# EAGLE design A4a STM32 (EAGLE 9.6.2)
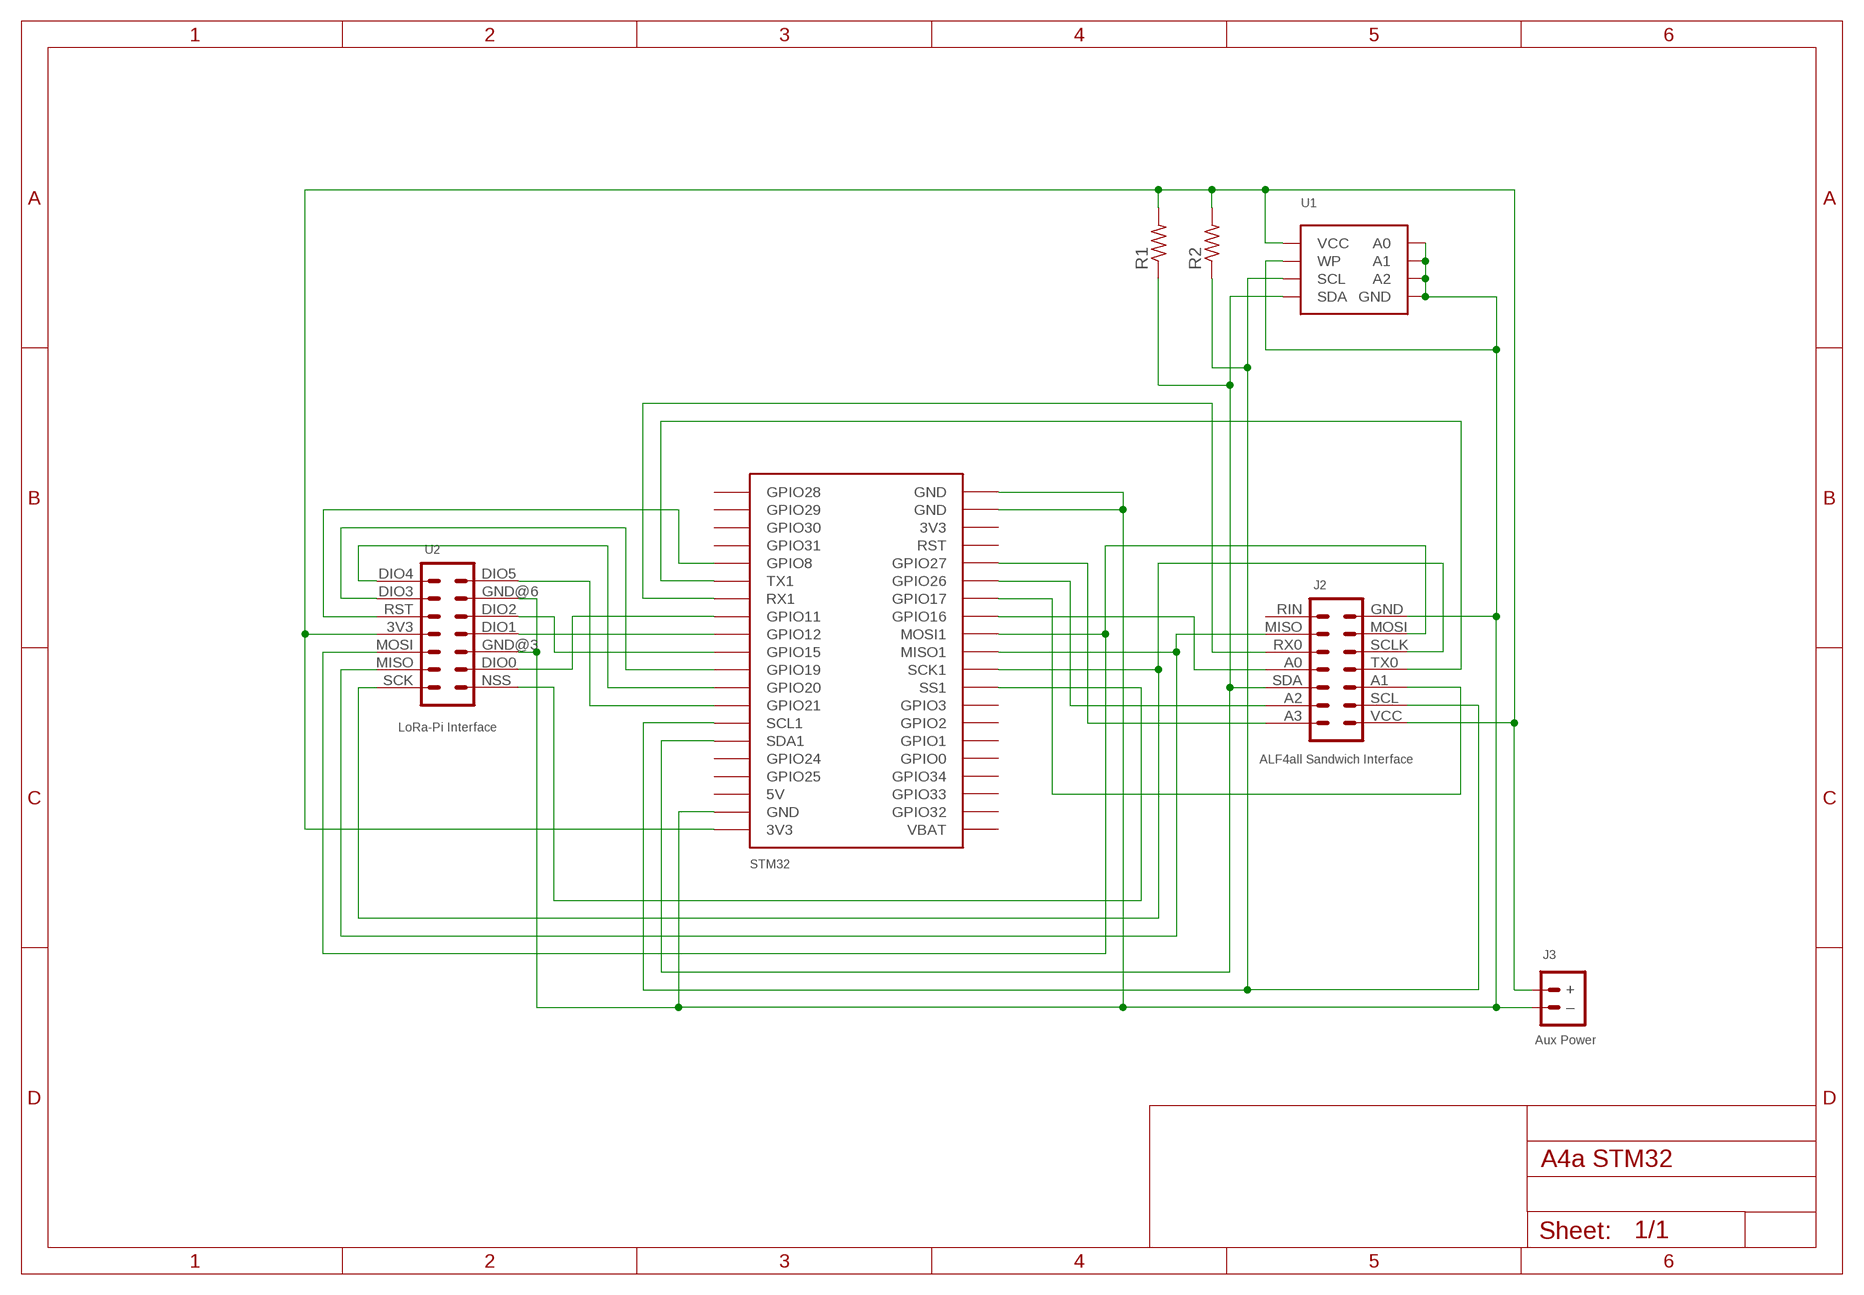
[diagram p0: schematic, sheet 1]

## Parts
J1  STM32  [STM32]
J2  ALF4all Sandwich Interface  HEADER-3X5-ALF4ALL-STM32-INTERCONNECT  [CONN_3X5-ALF4ALL-STM32-INTERCONNECT]
J3  Aux Power  JST-PH2.0-2-MALE-HORIZONTALJST-PTH-2  [JST-PH2.0-2-HORIZONTAL]
R1  RESISTORR0805  [R0805]
R2  RESISTORR0805  [R0805]
U1  AT24CXX-EEPROM-VIA-4  [SOP-8-WITH-VIA-4]
U2  LoRa-Pi Interface  RFM95W-PI-HEADER  [RFM95W-PI]

## Nets
GND: J1.GND@19(GND) J1.GND@20(GND) J1.GND@39(GND) J2.GND J3.-(–) U1.P$1(A0) U1.P$2(A1) U1.P$3(A2) U1.P$4(GND) U1.P$4@VIA(GND) U1.P$7(WP) U2.GND@3 U2.GND@6
N$1: J1.GPIO10(RX1) J2.RX0
N$2: J1.GPIO26 J2.A2
N$3: J1.GPIO22(SCL1) J2.SCL R2.1 U1.P$6(SCL)
N$4: J1.GPIO23(SDA1) J2.SDA R1.1 U1.P$5(SDA)
N$5: J1.GPIO16 J2.A0
N$6: J1.GPIO9(TX1) J2.TX0
N$7: J1.GPIO7(MOSI1) J2.MOSI U2.MOSI
N$8: J1.GPIO6(MISO1) J2.MISO U2.MISO
N$9: J1.GPIO27 J2.A3
N$11: J1.GPIO5(SCK1) J2.SCLK U2.SCK
N$12: J1.GPIO4(SS1) U2.NSS
N$13: J1.GPIO11 U2.DIO0
N$14: J1.GPIO12 U2.DIO1
N$15: J1.GPIO15 U2.DIO2
N$16: J1.GPIO19 U2.DIO3
N$17: J1.GPIO20 U2.DIO4
N$18: J1.GPIO21 U2.DIO5
N$19: J1.GPIO8 U2.RST
N$21: J1.GPIO17 J2.A1
VCC: J1.3V3@40(3V3) J2.VCC J3.+ R1.2 R2.2 U1.P$8(VCC) U2.3V3
Unconnected: J1.3V3@18(3V3) J1.5V@38(5V) J1.GPIO0 J1.GPIO1 J1.GPIO2 J1.GPIO3 J1.GPIO24 J1.GPIO25 J1.GPIO28 J1.GPIO29 J1.GPIO30 J1.GPIO31 J1.GPIO32 J1.GPIO33 J1.GPIO34 J1.RST J1.VBAT J2.RIN

## Library data of the parts
J1 = digitalconcepts:STM32: STM32 Development Board
J2 = digitalconcepts:HEADER-3X5-ALF4ALL-STM32-INTERCONNECT: ALF4all 'Sandwich' STM32 Interconnect 3x5 Pin Header Header soldered to top side of PCB
J3 = digitalconcepts:JST-PH2.0-2-MALE-HORIZONTAL: Multi connection point. Often used as Generic Header-pin footprint for 0.1 inch spaced/style header connections On any of the 0.1 inch spaced packages, you can populate with these: Break Away Headers - Straight <https://www.sparkfun.com/products/116> (PRT-00116) Break Away Male Headers - Right Angle <https://www.sparkfun.com/products/553> (PRT-00553) Female Headers <https://www.sparkfun.com/products/115> (PRT-00115) Break Away Headers - Machine Pin <https://www.sparkfun.com/products/117> (PRT-00117) Break Away Female Headers - Swiss Machine Pin <https://www.sparkfun.com/products/743> (PRT-00743) For SCREWTERMINALS and SPRING TERMINALS visit here: Screw Terimnals on SparkFun.com <https://www.sparkfun.com/search/results?term=Screw+Terminals> (5mm/3.5mm/2.54mm spacing) This device is also useful as a general connection point to wire up your design to another part of your project. Our various solder wires solder well into these plated through hole pads. Hook-Up Wire - Assortment (Stranded, 22 AWG) <https://www.sparkfun.com/products/11375> (PRT-11375) Hook-Up Wire - Assortment (Solid Core, 22 AWG) <https://www.sparkfun.com/products/11367> (PRT-11367) View the entire wire category on our website here <https://www.sparkfun.com/categories/141> Special notes: Molex polarized connector foot print use with: PRT-08233 with associated crimp pins and housings. 2.54_SCREWTERM for use with PRT-10571. 3.5mm Screw Terminal footprints for PRT-08084 5mm Screw Terminal footprints for use with PRT-08432; PROD_ID: CONN-09863; SKU: PRT-09914
R1 R2 = digitalconcepts:RESISTOR: Resistor; SPICEPREFIX: R
U1 = digitalconcepts:AT24CXX-EEPROM-VIA-4: AT24Cxx EEPROM SOP-8
U2 = digitalconcepts:RFM95W-PI-HEADER: RFM95W LoRa Wireless Transceiver Raspberry Pi Daughter Board

## Board
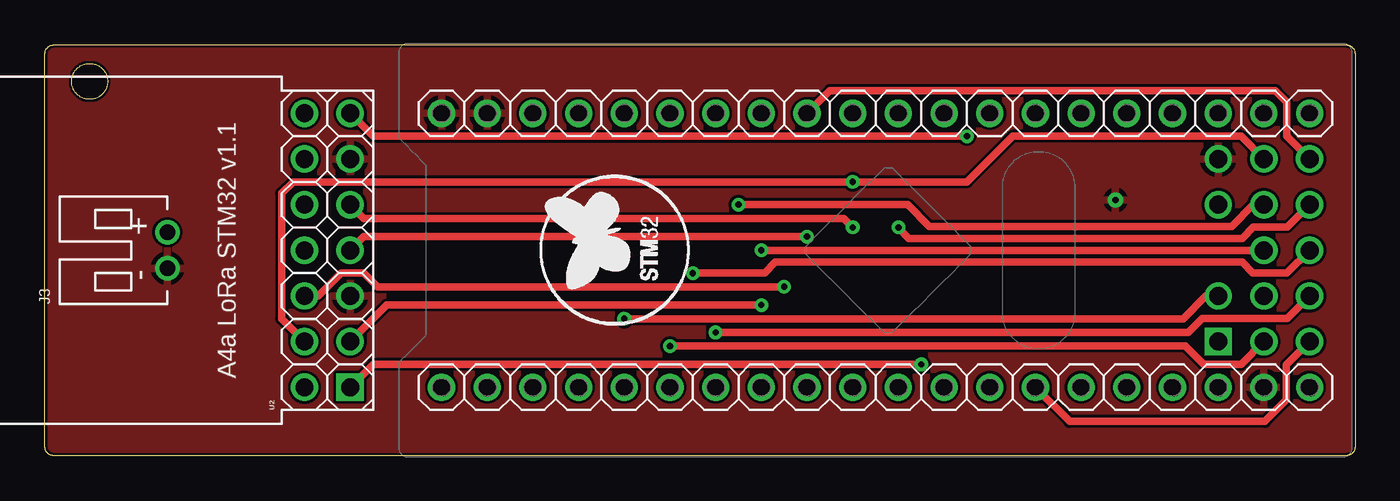
[diagram p1: board, top side]
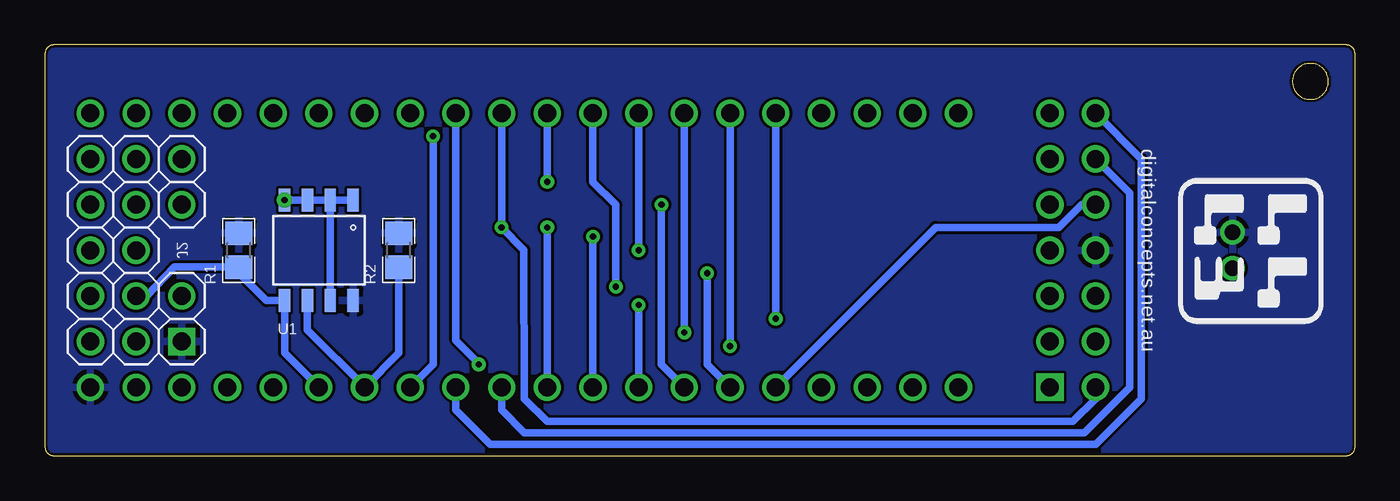
[diagram p2: board, bottom side, seen from below]

Size 72.84 x 22.86 mm. Coordinates in mm from the lower left corner, seen from the top.
Outline: 72.38,22.86 72.41,22.85 72.44,22.85 72.48,22.84 72.51,22.83 72.54,22.82 72.57,22.81 72.59,22.79 72.62,22.77 72.65,22.75 72.67,22.73 72.69,22.71 72.71,22.69 72.74,22.66 72.75,22.64 72.77,22.61 72.79,22.58 72.8,22.55 72.81,22.52 72.82,22.49 72.83,22.46 72.83,22.43 72.84,22.39 72.84,0.47 72.83,0.43 72.83,0.4 72.82,0.37 72.81,0.34 72.8,0.31 72.79,0.28 72.77,0.25 72.75,0.22 72.74,0.19 72.71,0.17 72.69,0.15 72.67,0.12 72.65,0.1 72.62,0.09 72.59,0.07 72.57,0.05 72.54,0.04 72.51,0.03 72.48,0.02 72.44,0.01 72.41,0 72.38,0 0.46,0 0.43,0 0.39,0.01 0.36,0.02 0.33,0.03 0.3,0.04 0.27,0.05 0.24,0.07 0.22,0.09 0.19,0.1 0.17,0.12 0.14,0.15 0.12,0.17 0.1,0.19 0.08,0.22 0.07,0.25 0.05,0.28 0.03,0.34 0.02,0.37 0.01,0.4 0,0.43 0,0.47 0,22.39 0,22.43 0.01,22.46 0.02,22.49 0.03,22.52 0.05,22.58 0.07,22.61 0.08,22.64 0.1,22.66 0.12,22.69 0.14,22.71 0.17,22.73 0.19,22.75 0.22,22.77 0.24,22.79 0.27,22.81 0.3,22.82 0.33,22.83 0.36,22.84 0.39,22.85 0.43,22.85 0.46,22.86 72.38,22.86
Outline: 2.55,21.83 2.62,21.82 2.68,21.81 2.75,21.79 2.81,21.77 2.87,21.75 2.93,21.72 2.99,21.69 3.04,21.66 3.09,21.62 3.14,21.58 3.19,21.53 3.23,21.49 3.27,21.44 3.31,21.39 3.35,21.33 3.38,21.28 3.4,21.22 3.43,21.16 3.45,21.09 3.46,21.03 3.47,20.96 3.48,20.9 3.48,20.76 3.47,20.69 3.46,20.63 3.45,20.56 3.43,20.5 3.4,20.44 3.38,20.38 3.35,20.32 3.31,20.27 3.27,20.22 3.23,20.17 3.14,20.08 3.09,20.03 3.04,20 2.99,19.96 2.93,19.93 2.87,19.91 2.81,19.88 2.75,19.86 2.68,19.85 2.62,19.83 2.55,19.83 2.41,19.83 2.34,19.83 2.28,19.85 2.21,19.86 2.15,19.88 2.09,19.91 2.03,19.93 1.97,19.96 1.92,20 1.87,20.03 1.82,20.08 1.73,20.17 1.69,20.22 1.65,20.27 1.62,20.32 1.58,20.38 1.56,20.44 1.53,20.5 1.51,20.56 1.5,20.63 1.49,20.69 1.48,20.76 1.48,20.9 1.49,20.96 1.5,21.03 1.51,21.09 1.53,21.16 1.56,21.22 1.58,21.28 1.62,21.33 1.65,21.39 1.69,21.44 1.73,21.49 1.77,21.53 1.82,21.58 1.87,21.62 1.92,21.66 1.97,21.69 2.03,21.72 2.09,21.75 2.15,21.77 2.21,21.79 2.28,21.81 2.34,21.82 2.41,21.83 2.55,21.83
Copper layers (1*16): Top 0.035mm / dielectric 1.5mm / Bottom 0.035mm
Design rules "default *": minimum track width 6mil, minimum drill 0.35mm, track to track 6mil, track to pad 6mil, pad to pad 6mil, via to via 6mil, smd to smd 6mil, copper to edge 6mil, drill to drill 6mil, minimum pad ring 10mil, minimum via ring 8mil, stop-mask expansion 4mil, vias tented up to drill 0mil, thermal gap 10mil

### Footprints (pad centres in the part's own frame; a part is rotated, then mirrored left to right if it is on the bottom)
STM32 = drill 1: 3V3@18 0,43.18; 3V3@40 -15.24,0; 5V@38 -15.24,5.08; GND@19 0,45.72; GND@20 0,48.26; GND@39 -15.24,2.54; GPIO0 0,10.16; GPIO1 0,12.7; GPIO2 0,15.24; GPIO3 0,17.78; GPIO4 0,20.32; GPIO5 0,22.86; GPIO6 0,25.4; GPIO7 0,27.94; GPIO8 -15.24,38.1; GPIO9 -15.24,35.56; GPIO10 -15.24,33.02; GPIO11 -15.24,30.48; GPIO12 -15.24,27.94; GPIO15 -15.24,25.4; GPIO16 0,30.48; GPIO17 0,33.02; GPIO19 -15.24,22.86; GPIO20 -15.24,20.32; GPIO21 -15.24,17.78; GPIO22 -15.24,15.24; GPIO23 -15.24,12.7; GPIO24 -15.24,10.16; GPIO25 -15.24,7.62; GPIO26 0,35.56; GPIO27 0,38.1; GPIO28 -15.24,48.26; GPIO29 -15.24,45.72; GPIO30 -15.24,43.18; GPIO31 -15.24,40.64; GPIO32 0,2.54; GPIO33 0,5.08; GPIO34 0,7.62; RST 0,40.64; VBAT 0,0
CONN_3X5-ALF4ALL-STM32-INTERCONNECT = drill 1 pad 1.524: A0 5.08,-2.54; A1 2.54,-5.08; A2 0,-2.54; A3 2.54,0; GND 10.16,0; MISO 10.16,-2.54; MOSI 10.16,-5.08; RIN 7.62,0; RX0 7.62,-2.54; SCL 0,-5.08; SCLK 7.62,-5.08; SDA 2.54,-2.54; TX0 5.08,-5.08 | drill 1 pad 1.524 square: VCC 0,0
JST-PH2.0-2-HORIZONTAL = drill 0.85: + 1,0; - -1,0
R0805 = smd 1.3 x 1.5: 1 -0.95,0; 2 0.95,0
SOP-8-WITH-VIA-4 = smd 0.635 x 1.27: P$1 -1.905,-2.794; P$2 -0.635,-2.794; P$3 0.635,-2.794; P$4 1.905,-2.794; P$5 1.905,2.794; P$6 0.635,2.794; P$7 -0.635,2.794; P$8 -1.905,2.794 | drill 0.35 pad 0.61: P$4@VIA 1.905,-2.794
RFM95W-PI = drill 1 pad 1.524: 3V3 7.62,2.54; DIO0 2.54,0; DIO1 7.62,0; DIO2 10.16,0; DIO3 12.7,2.54; DIO4 15.24,2.54; DIO5 15.24,0; GND@3 5.08,0; GND@6 12.7,0; MISO 2.54,2.54; MOSI 5.08,2.54; RST 10.16,2.54; SCK 0,2.54 | drill 1 pad 1.524 square: NSS 0,0

### Placement (x,y rotation side)
J1  70.31,19.05 90 top
J2  65.23,6.35 90 top
J3  6.81,11.43 90 top
R1  62.05,11.43 90 bottom
R2  53.16,11.43 90 bottom
U1  57.61,11.43 180 bottom
U2  16.97,3.81 90 top

### Tracks (layer width: path | path; a pad name or v marks a point on that pad's centre or on a via)
GND
  Bottom 0.406: U1.P$4@VIA U1.P$3 U1.P$2 | U1.P$2 U1.P$1 | U1.P$2 U1.P$7
  pour Top (rank 3): -2.08,25.4 75.39,25.4 75.39,-2.54 -2.08,-2.54
N$1  (via drill 0.35)
  Top 0.406: J2.RX0 67.19,13.97 65.99,12.75 49.15,12.75 47.96,13.97 v38.56,13.97
  Bottom 0.406: J1.GPIO10 38.56,5.08 v38.56,13.97
N$2  (via drill 0.35)
  Top 0.406: J2.A2 66.5,5.08 64.42,5.08 63.4,6.1 v34.75,6.1
  Bottom 0.406: J1.GPIO26 v34.75,6.1
N$3
  Top 0.406: J1.GPIO22 56.97,1.9 67.82,1.9 69.01,3.1 69.01,5.05 J2.SCL
  Bottom 0.406: R2.1 53.16,5.71 J1.GPIO22 55.07,3.82 58.24,7 U1.P$6
N$4
  Bottom 0.406: J2.SDA 67.19,8.89 65.65,10.49 62.17,10.49 62.16,10.48 R1.1 62.05,10.16 60.53,8.64 U1.P$5 59.51,5.73 57.61,3.82 J1.GPIO23
N$5  (via drill 0.35)
  Top 0.406: J2.A0 v39.83,11.43
  Bottom 0.406: J1.GPIO16 v39.83,11.43
N$6  (via drill 0.35)
  Top 0.406: J2.TX0 69.04,10.16 67.16,10.16 66.58,10.77 40.59,10.77 40.01,10.16 v36.02,10.16
  Bottom 0.406: v36.02,10.16 36.02,5.08 J1.GPIO9
N$7  (via drill 0.35)
  Top 0.406: v41.1,9.4 18.49,9.4 17.73,10.16 16.46,10.16 15.19,8.89 U2.MOSI | J2.MOSI 69.04,17.78 69.04,19.68 68.4,20.32 43.64,20.32 J1.GPIO7
  Bottom 0.406: J1.GPIO7 42.37,15.24 41.1,13.97 v41.1,9.4
N$8  (via drill 0.35)
  Top 0.406: J2.MISO 66.5,17.78 53.8,17.78 51.26,15.24 v44.91,15.24 13.79,15.24 13.16,14.6 13.16,7.62 U2.MISO
  Bottom 0.406: v44.91,15.24 J1.GPIO6
N$9  (via drill 0.35)
  Top 0.406: J2.A3 64.54,8.89 63.27,7.62 v32.21,7.62
  Bottom 0.406: J1.GPIO27 v32.21,7.62
N$11  (via drill 0.35)
  Top 0.406: J2.SCLK 69.06,12.72 67.19,12.72 66.58,12.09 48.03,12.09 v47.45,12.7
  Bottom 0.406: J1.GPIO5 v47.45,12.7 46.2,11.45 46.18,3.17 44.91,1.9 15.7,1.9 14.43,3.17 U2.SCK
N$12  (via drill 0.35)
  Top 0.406: U2.NSS 18.24,5.08 v48.72,5.08
  Bottom 0.406: J1.GPIO4 49.99,6.42 48.72,5.13 v48.72,5.08
N$13  (via drill 0.35)
  Top 0.406: v39.83,8.38 19,8.38 U2.DIO0
  Bottom 0.406: v39.83,8.38 J1.GPIO11
N$14  (via drill 0.35)
  Top 0.406: U2.DIO1 17.73,12.19 v42.37,12.19
  Bottom 0.406: v42.37,12.19 J1.GPIO12
N$15  (via drill 0.35)
  Top 0.406: U2.DIO2 17.73,13.21 44.4,13.21 v44.91,12.7
  Bottom 0.406: v44.91,12.7 J1.GPIO15
N$16
  Bottom 0.406: U2.DIO3 12.52,14.6 12.52,3.81 15.06,1.27 46.18,1.27 47.45,2.54 J1.GPIO19
N$17
  Bottom 0.406: U2.DIO4 11.89,16.51 11.89,3.17 14.43,0.63 48.08,0.63 49.99,2.54 J1.GPIO20
N$18  (via drill 0.35)
  Top 0.406: U2.DIO5 18.24,17.78 v51.26,17.78
  Bottom 0.406: v51.26,17.78 51.26,5.08 J1.GPIO21
N$19
  Bottom 0.406: U2.RST 15.19,13.97 16.46,12.7 23.32,12.7 J1.GPIO8
N$21  (via drill 0.35)
  Top 0.406: J2.A1 69.06,7.64 64.34,7.64 63.55,6.86 v37.29,6.86
  Bottom 0.406: J1.GPIO17 v37.29,6.86
VCC
  pour Bottom (rank 3): -0.81,24.13 74.12,24.13 74.12,-1.27 -0.81,-1.27

### Text on the board
tPlace: A4a LoRa STM32 v1.1
bPlace: digitalconcepts.net.au